# Altium schematic sheet PowerSupply.SchDoc (part 3 of 3)
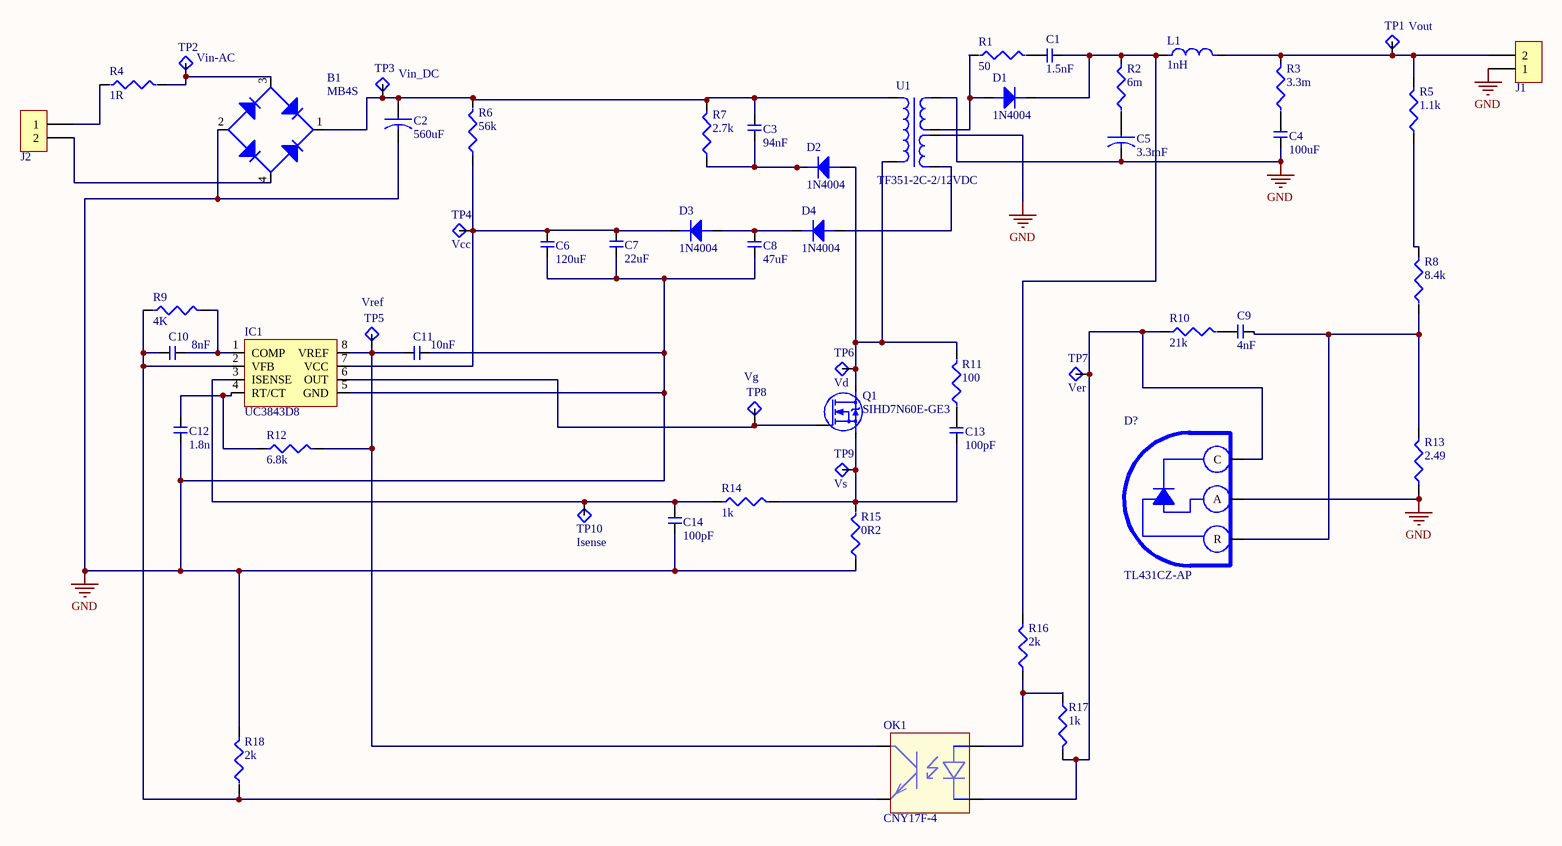
[diagram p2: PowerSupply.SchDoc]

## Library data of the parts (continued)
R12 = ERA-3AEB682V: Res Thin Film 0603 6.8K Ohm 0.1% 0.1W ±25ppm/°C Molded SMD Punched Carrier T/R; Manufacturer: Panasonic; Power Rating: 100mW; Resistance: 6.8kR; Voltage Rating (DC): 75V; Supplier 1: Mouser; Manufacturer Part Number: ERA-3AEB682V; RoHS: Yes; Category: Chip SMD Resistors; Stock 1: 114872; Pricing 1: 1=0.32, 10=0.141, 50=0.141, 100=0.064, 1000=0.044, 10000=0.034 (USD); Mount: Surface Mount; Case/Package: 0603; Number of Pins: 2; Case Code (Metric): 1608; Case Code (Imperial): 0603; Size Code: 0603; Contact Plating: Tin; Min Operating Temperature: -55°C; Max Operating Temperature: 155°C; Tolerance: 0.1%; Temperature Coefficient: 25ppm/°C; Packaging: Tape and Reel; Series: ERA-3A; Package Quantity: 5000; Number of Terminations: 2; Max Power Dissipation: 100mW; Voltage Rating: 75V; Termination: SMD/SMT; Features: Automotive AEC-Q200; Resistance Tolerance: 0.1%; Technology: METAL FILM; Resistor Type: Thin Film; Construction: Rectangular; Length: 1.6mm; Width: 0.8mm; Height: 0.45mm; Depth: 0.8mm; Ratings: AEC-Q200; Radiation Hardening: No; RoHS Compliant: Yes; Lead Free: Lead Free; Reach SVHC Compliant: No; Military Standard: Not; ComponentLink1URL: https://datasheet.ciiva.com/11808/0900766b80fe20f7-11808071.pdf?src-supplier=Rs; ComponentLink1Description: https://datasheet.ciiva.com/11808/0900766b80fe20f7-11808071.pdf?src-supplier=Rs; ComponentLink2URL: https://datasheet.ciiva.com/29183/451189-da-01-en-widerstand-0603-era-29183798.pdf?src-supplier=Conrad; ComponentLink2Description: https://datasheet.ciiva.com/29183/451189-da-01-en-widerstand-0603-era-29183798.pdf?src-supplier=Conrad; ComponentLink3URL: https://datasheet.ciiva.com/46436/485442-46436582.pdf?src-supplier=Element14; ComponentLink3Description: https://datasheet.ciiva.com/46436/485442-46436582.pdf?src-supplier=Element14; ComponentLink4URL: https://datasheet.ciiva.com/16765/70068849-16765606.pdf?src-supplier=Allied+Electronics; ComponentLink4Description: https://datasheet.ciiva.com/16765/70068849-16765606.pdf?src-supplier=Allied+Electronics; ComponentLink5URL: https://datasheet.ciiva.com/16781/70068849-16781910.pdf?src-supplier=Allied+Electronics; ComponentLink5Description: https://datasheet.ciiva.com/16781/70068849-16781910.pdf?src-supplier=Allied+Electronics; ComponentLink6URL: https://datasheet.ciiva.com/9195/aoa0000ce26-9195021.pdf?src-supplier=Avnet; ComponentLink6Description: https://datasheet.ciiva.com/9195/aoa0000ce26-9195021.pdf?src-supplier=Avnet; ComponentLink7URL: https://datasheet.ciiva.com/9117/aoa0000ce26-9117749.pdf?src-supplier=Avnet; ComponentLink7Description: https://datasheet.ciiva.com/9117/aoa0000ce26-9117749.pdf?src-supplier=Avnet; ComponentLink8URL: https://datasheet.ciiva.com/43455/485442-43455229.pdf?src-supplier=Farnell; ComponentLink8Description: https://datasheet.ciiva.com/43455/485442-43455229.pdf?src-supplier=Farnell; ComponentLink9URL: https://datasheet.ciiva.com/46436/485442-46436581.pdf?src-supplier=Element14; ComponentLink9Description: https://datasheet.ciiva.com/46436/485442-46436581.pdf?src-supplier=Element14; ComponentLink10URL: https://datasheet.ciiva.com/6137/485442-6137973.pdf?src-supplier=Farnell; ComponentLink10Description: https://datasheet.ciiva.com/6137/485442-6137973.pdf?src-supplier=Farnell; ComponentLink11URL: https://datasheet.ciiva.com/7802/485442-7802270.pdf?src-supplier=Element14; ComponentLink11Description: https://datasheet.ciiva.com/7802/485442-7802270.pdf?src-supplier=Element14; ComponentLink12URL: https://datasheet.ciiva.com/24069/aoa0000ce26-32660-24069673.pdf?src-supplier=Mouser; ComponentLink12Description: https://datasheet.ciiva.com/24069/aoa0000ce26-32660-24069673.pdf?src-supplier=Mouser; ComponentLink13URL: https://datasheet.ciiva.com/16212/aoa0000ce26-16212104.pdf?src-supplier=Future+Electronics; ComponentLink13Description: https://datasheet.ciiva.com/16212/aoa0000ce26-16212104.pdf?src-supplier=Future+Electronics; ComponentLink14URL: https://datasheet.ciiva.com/48425/era-eng-tds-48425486.pdf?src-supplier=Distrelec; ComponentLink14Description: https://datasheet.ciiva.com/48425/era-eng-tds-48425486.pdf?src-supplier=Distrelec
R13 = CRCW08052K49FKEB: Res Thick Film 0805 2.49K Ohm 1% 1/8W ±100ppm/°C Molded SMD SMD Paper T/R; Manufacturer: Vishay Dale; Resistance: 2.49kR; Max Power Dissipation: 125mW; Voltage Rating: 150V; Supplier 1: Mouser; Manufacturer Part Number: CRCW08052K49FKEB; RoHS: Yes; Category: Chip SMD Resistors; Stock 1: 30628; Pricing 1: 1=0.1, 10=0.033, 50=0.033, 100=0.015, 1000=0.011, 10000=0.006 (USD); Case/Package: 0805; Case Code (Imperial): 0805; Case Code (Metric): 2012; Contact Plating: Tin; Weight: 0.000194oz; Min Operating Temperature: -55°C; Max Operating Temperature: 155°C; Packaging: Tape and Reel; Tolerance: 1%; Temperature Coefficient: 100ppm/°C; Series: CRCW; Number of Terminations: 2; Power Rating: 125mW; Package Quantity: 10000; Features: Automotive AEC-Q200; Termination: SMD/SMT; Length: 0.079inch; Width: 1.25mm; Height: 0.02inch; Radiation Hardening: No; Lead Free: Lead Free; RoHS Compliant: Yes; ComponentLink1URL: https://datasheet.ciiva.com/9087/dcrcwe3-9087438.pdf?src-supplier=Avnet; ComponentLink1Description: https://datasheet.ciiva.com/9087/dcrcwe3-9087438.pdf?src-supplier=Avnet; ComponentLink2URL: https://datasheet.ciiva.com/5575/dcrcwe3-109170-5575543.pdf?src-supplier=Mouser; ComponentLink2Description: https://datasheet.ciiva.com/5575/dcrcwe3-109170-5575543.pdf?src-supplier=Mouser
R14 R17 = ERJ-3EKF1001V: Res Thick Film 0603 1K Ohm 1% 1/10W ±100ppm/°C Molded SMD Punched Carrier T/R; Manufacturer: Panasonic; Resistance: 1kR; Power Rating: 100mW; Voltage Rating: 75V; Supplier 1: Mouser; Manufacturer Part Number: ERJ-3EKF1001V; RoHS: Yes; Category: Chip SMD Resistors; Stock 1: 2068978; Pricing 1: 1=0.1, 10=0.02, 50=0.02, 100=0.012, 1000=0.008, 10000=0.005 (USD); Mount: Surface Mount; Case/Package: 0603; Number of Pins: 2; Case Code (Metric): 1608; Case Code (Imperial): 0603; Contact Plating: Tin; Size Code: 0603; Min Operating Temperature: -55°C; Max Operating Temperature: 155°C; Packaging: Tape and Reel; Termination: SMD/SMT; Series: ERJ; Tolerance: 1%; Resistance Tolerance: 1%; Package Quantity: 5000; Temperature Coefficient: 100ppm/°C; Max Power Dissipation: 100mW; Voltage Rating (DC): 75V; Resistor Type: Thick Film; Number of Terminations: 2; Features: Automotive AEC-Q200; Technology: THICK FILM; Construction: Rectangular; Length: 1.6mm; Width: 0.8mm; Height: 0.45mm; Depth: 0.8mm; Radiation Hardening: No; Reach SVHC Compliant: No; RoHS Compliant: Yes; Lead Free: 5697LeadFree; Military Standard: Not
R15 = RMCF0402ZT0R00: Res Thick Film 0402 0 Ohm Jumper Molded SMD Paper T/R; Manufacturer: Stackpole Electronics; Resistance: 0R; Power Rating: 63mW; Current Rating: 1A; Working Voltage: 50V; Supplier 1: Arrow Electronics; Manufacturer Part Number: RMCF0402ZT0R00; RoHS: Yes; Category: Chip SMD Resistors; Stock 1: 1190000; Pricing 1: 10000=0.0012, 30000=0.0011 (USD); Mount: Surface Mount; Case/Package: 0402; Case Code (Metric): 1005; Case Code (Imperial): 0402; Contact Plating: Tin,Matte; Min Operating Temperature: -55°C; Max Operating Temperature: 155°C; Packaging: Tape and Reel; Number of Terminations: 2; Max Power Dissipation: 63mW; Features: Automotive AEC-Q200; Series: RMCF; Technology: THICK FILM; Construction: Rectangular; Voltage Rating: 50V; Length: 0.039inch; Width: 0.02inch; Height: 0.016inch; Depth: 0.5mm; Radiation Hardening: No; Military Standard: Not; RoHS Compliant: Yes; Lead Free: 5697LeadFree; ComponentLink1URL: https://datasheet.ciiva.com/26835/getdatasheetpartid-409751-26835612.pdf?src-supplier=Verical; ComponentLink1Description: https://datasheet.ciiva.com/26835/getdatasheetpartid-409751-26835612.pdf?src-supplier=Verical
R16 R18 = RNCF0603TKY2K00: RNCF Precision Thin Film Chip Resistor 0603 Size 2K Ohm 0.01% 0.1 W 5 ppm/°C 2-Pin SMD T/R; Manufacturer: Stackpole Electronics; Resistance: 2kR; Max Power Dissipation: 100mW; Voltage Rating: 75V; Supplier 1: Arrow Electronics; Manufacturer Part Number: RNCF0603TKY2K00; RoHS: Yes; Category: Chip SMD Resistors; Stock 1: 494; Pricing 1: 1=1.8516, 10=1.5643, 25=1.415, 100=1.196, 250=1.1894, 500=0.8725 (USD); Mount: Surface Mount; Case/Package: 0603; Case Code (Metric): 1608; Case Code (Imperial): 0603; Min Operating Temperature: -55°C; Max Operating Temperature: 155°C; Packaging: Tape and Reel; Number of Terminations: 2; Tolerance: 0.01%; Temperature Coefficient: 5ppm/°C; Features: Moisture Resistant,Automotive AEC-Q200; Series: RNCF; Length: 0.063inch; Width: 0.031inch; Height: 0.022inch; Ratings: AEC-Q200; RoHS Compliant: Yes; ComponentLink1URL: https://www.seielect.com/Catalog/SEI-RNCF.pdf?src-supplier=Digikey; ComponentLink1Description: https://www.seielect.com/Catalog/SEI-RNCF.pdf?src-supplier=Digikey; ComponentLink2URL: https://www.seielect.com/catalog/SEI-Packaging.pdf?src-supplier=Digikey; ComponentLink2Description: https://www.seielect.com/catalog/SEI-Packaging.pdf?src-supplier=Digikey
TP1-TP10 = Test_Point_3
U1 = TF351-2C-2/12VDC: TF351-2C-2/12VDC Unchecked Electromechanical Relay DPDT 5A 12VDC 134Ohm Plug-In Uncategorized